# EAGLE design bt-ir-blaster (EAGLE 6.5.0)
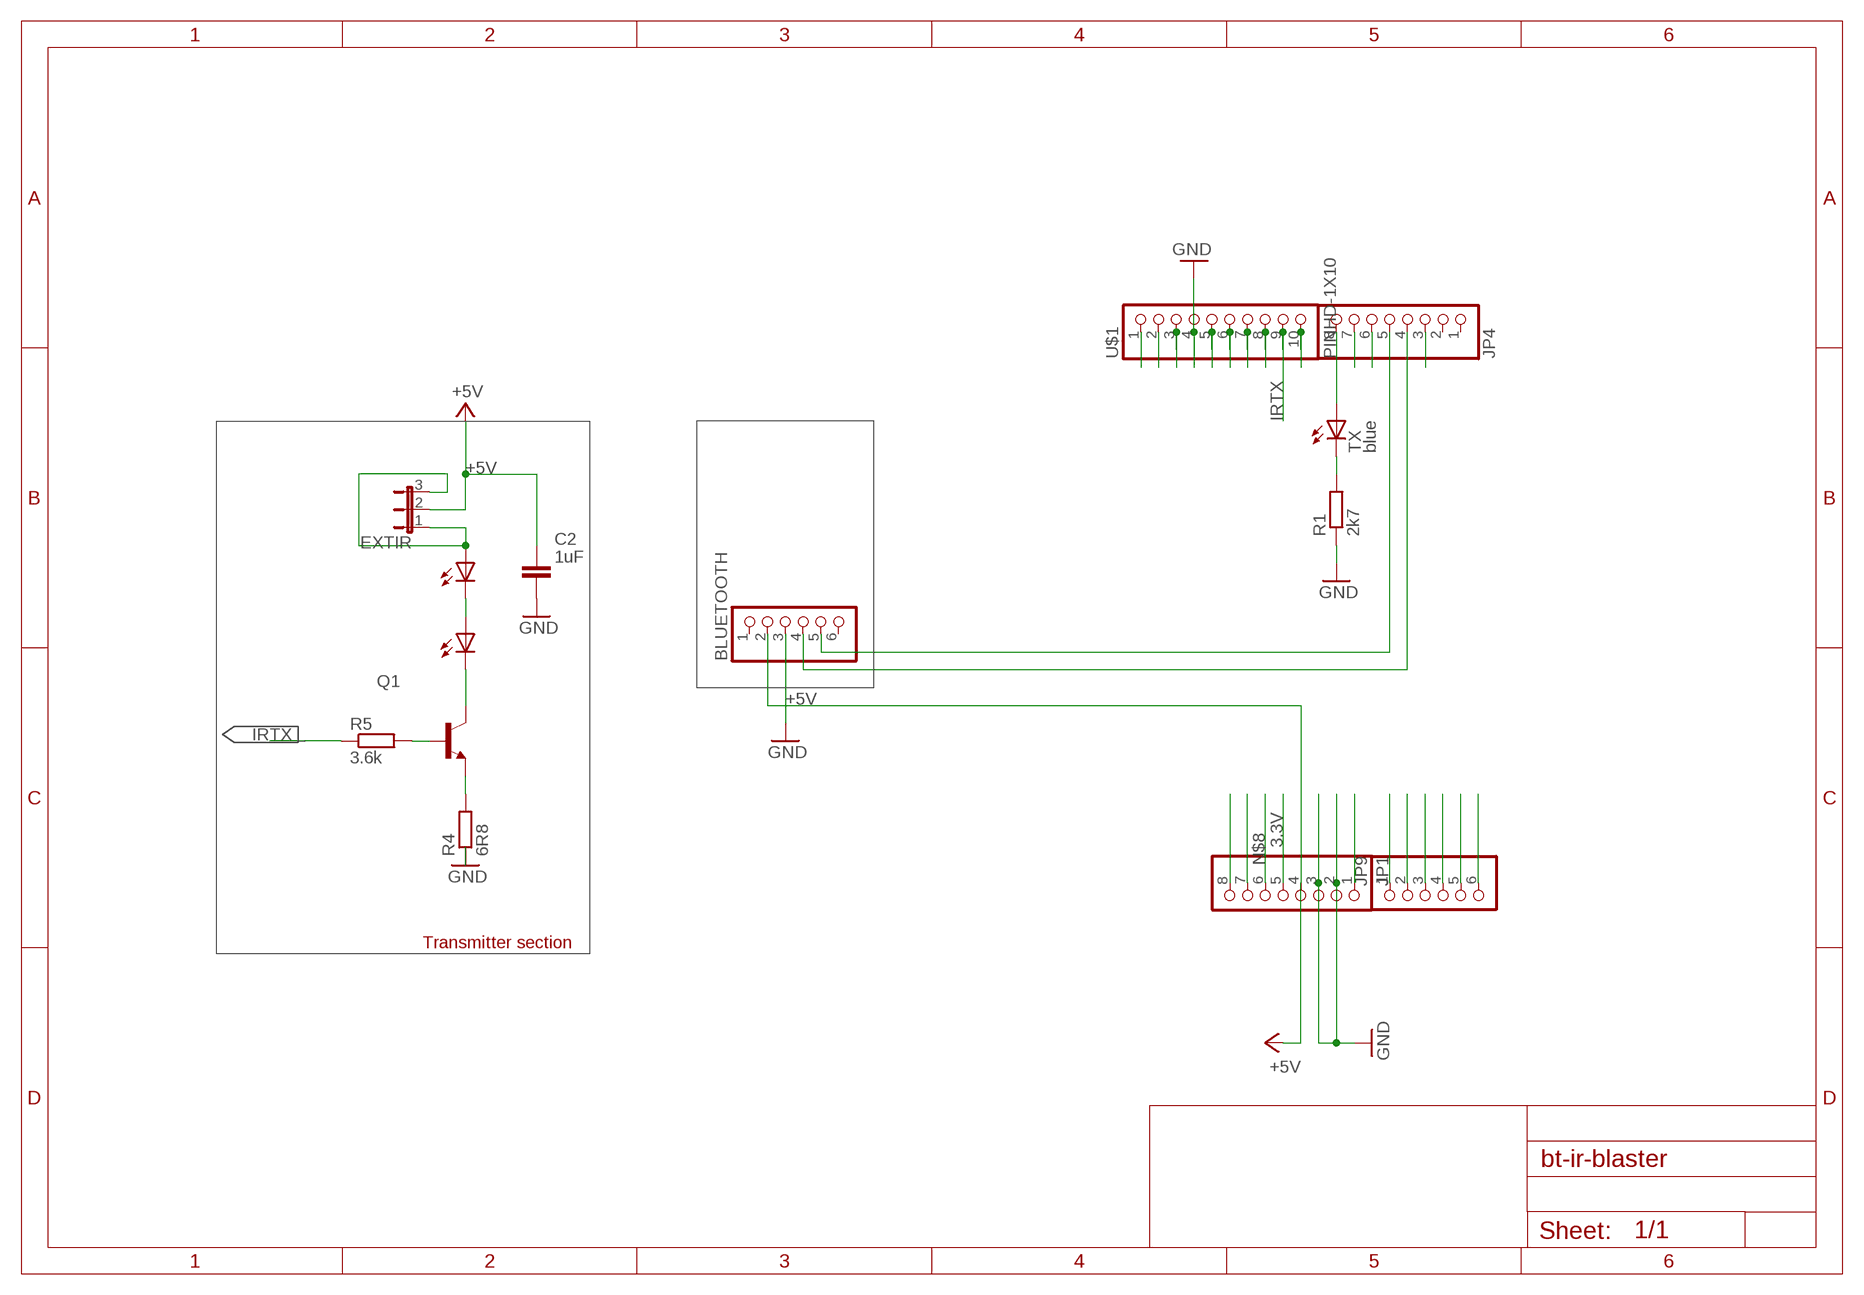
[diagram p0: schematic, sheet 1]

## Parts
BLUETOOTH  PINHD-1X6  [1X06]
C2  1uF  CAPACITOR_NPOL-0603  [C603@1]
EXTIR  JP2E  [JP2]
JP1  PINHD-1X8BIG  [1X08-BIG]
JP4  PINHD-1X8BIG  [1X08-BIG]
JP9  PINHD-1X6B  [1X06-BIG]
Q1  TRANSISTOR_BJT_NPN-SOT-23-BCE  [SOT-23]
R1  2k7  R-EU_R0805  [R0805]
R4  6R8  R-EU_R1206  [R1206]
R5  3.6k  R-EU_R0603  [R0603]
TX  blue  LED3MM  [LED3MM]
U$1  PINHD-1X10  [1X10-BIG]
U$5  IRLED5MM  [IRLED_HOLDER]
U$7  IRLED5MM  [IRLED_HOLDER]

## Nets
3.3V: JP1.5
+5V: BLUETOOTH.2 C2.1 EXTIR.2 JP1.4
A: Q1.2(C) U$5.K(C)
GND: BLUETOOTH.3 C2.2 JP1.2 JP1.3 R1.1 R4.1 U$1.4
IRTX: R5.1 U$1.9
K: Q1.3(E) R4.2
N$2: U$1.3
N$3: Q1.1(B) R5.2
N$4: JP1.8
N$5: U$1.5
N$6: U$5.A U$7.K(C)
N$7: R1.2 TX.K(C)
N$8: JP1.6
N$9: EXTIR.1 EXTIR.3 U$7.A
N$15: JP1.7
N$45: U$1.6
N$54: U$1.7
N$55: U$1.8
N$57: U$1.10
N$58: JP9.1
N$59: JP9.2
N$70: JP9.3
N$88: JP9.4
N$89: JP9.5
N$92: JP9.6
N$93: BLUETOOTH.4 JP4.4
N$94: BLUETOOTH.5 JP4.5
N$115: JP4.3
N$135: JP4.6
N$145: JP4.7
N$152: JP4.8 TX.A
N$153: JP1.1
N$154: U$1.1
N$164: U$1.2
Unconnected: BLUETOOTH.1 BLUETOOTH.6 JP4.1 JP4.2

## Notes on the sheet
- Transmitter section

## Library data of the parts
BLUETOOTH = pinhead:PINHD-1X6: PIN HEADER
C2 = dp_devices:CAPACITOR_NPOL: Non-Polarized capacitor in various packages
EXTIR = jumper:JP2E: JUMPER
JP1 JP4 = carduino:PINHD-1X8: PIN HEADER
JP9 = carduino:PINHD-1X6: PIN HEADER
Q1 = dp_devices:TRANSISTOR_BJT_NPN: Most commonly used is SOT23-BEC
R1 R4 R5 = resistor:R-EU_: RESISTOR, European symbol
TX = led:LED: LED OSRAM: - CHIPLED LG R971, LG N971, LY N971, LG Q971, LY Q971, LO R971, LY R971 LH N974, LH R974 LS Q976, LO Q976, LY Q976 LO Q996 - Hyper CHIPLED LW Q18S LB Q993, LB Q99A, LB R99A - SideLED LS A670, LO A670, LY A670, LG A670, LP A670 LB A673, LV A673, LT A673, LW A673 LH A674 LY A675 LS A676, LA A676, LO A676, LY A676, LW A676 LS A679, LY A679, LG A679 - Hyper Micro SIDELED® LS Y876, LA Y876, LO Y876, LY Y876 LT Y87S - SmartLED LW L88C, LW L88S LB L89C, LB L89S, LG L890 LS L89K, LO L89K, LY L89K LS L896, LA L896, LO L896, LY L896 - TOPLED LS T670, LO T670, LY T670, LG T670, LP T670 LSG T670, LSP T670, LSY T670, LOP T670, LYG T670 LG T671, LOG T671, LSG T671 LB T673, LV T673, LT T673, LW T673 LH T674 LS T676, LA T676, LO T676, LY T676, LB T676, LH T676, LSB T676, LW T676 LB T67C, LV T67C, LT T67C, LS T67K, LO T67K, LY T67K, LW E67C LS E67B, LA E67B, LO E67B, LY E67B, LB E67C, LV E67C, LT E67C LW T67C LS T679, LY T679, LG T679 LS T770, LO T770, LY T770, LG T770, LP T770 LB T773, LV T773, LT T773, LW T773 LH T774 LS E675, LA E675, LY E675, LS T675 LS T776, LA T776, LO T776, LY T776, LB T776 LHGB T686 LT T68C, LB T68C - Hyper Mini TOPLED® LB M676 - Mini TOPLED Santana® LG M470 LS M47K, LO M47K, LY M47K Source: http://www.osram.convergy.de LUXEON: - LUMILED® LXK2-PW12-R00, LXK2-PW12-S00, LXK2-PW14-U00, LXK2-PW14-V00 LXK2-PM12-R00, LXK2-PM12-S00, LXK2-PM14-U00 LXK2-PE12-Q00, LXK2-PE12-R00, LXK2-PE12-S00, LXK2-PE14-T00, LXK2-PE14-U00 LXK2-PB12-K00, LXK2-PB12-L00, LXK2-PB12-M00, LXK2-PB14-N00, LXK2-PB14-P00, LXK2-PB14-Q00 LXK2-PR12-L00, LXK2-PR12-M00, LXK2-PR14-Q00, LXK2-PR14-R00 LXK2-PD12-Q00, LXK2-PD12-R00, LXK2-PD12-S00 LXK2-PH12-R00, LXK2-PH12-S00 LXK2-PL12-P00, LXK2-PL12-Q00, LXK2-PL12-R00 Source: www.luxeon.com KINGBRIGHT: KA-3528ASYC Source: www.kingbright.com
U$1 = adafruit:PINHD-1X10: Pin header 1x10 0.1" spacing With round pins
U$5 U$7 = IRLED_holder:IRLED5MM

## Net classes
2 gnd: width 0.305 mm, drill 0.559 mm, clearance 0.254 mm
3 usbvcc: width 0.305 mm, drill 0.61 mm, clearance 0.254 mm

## Board
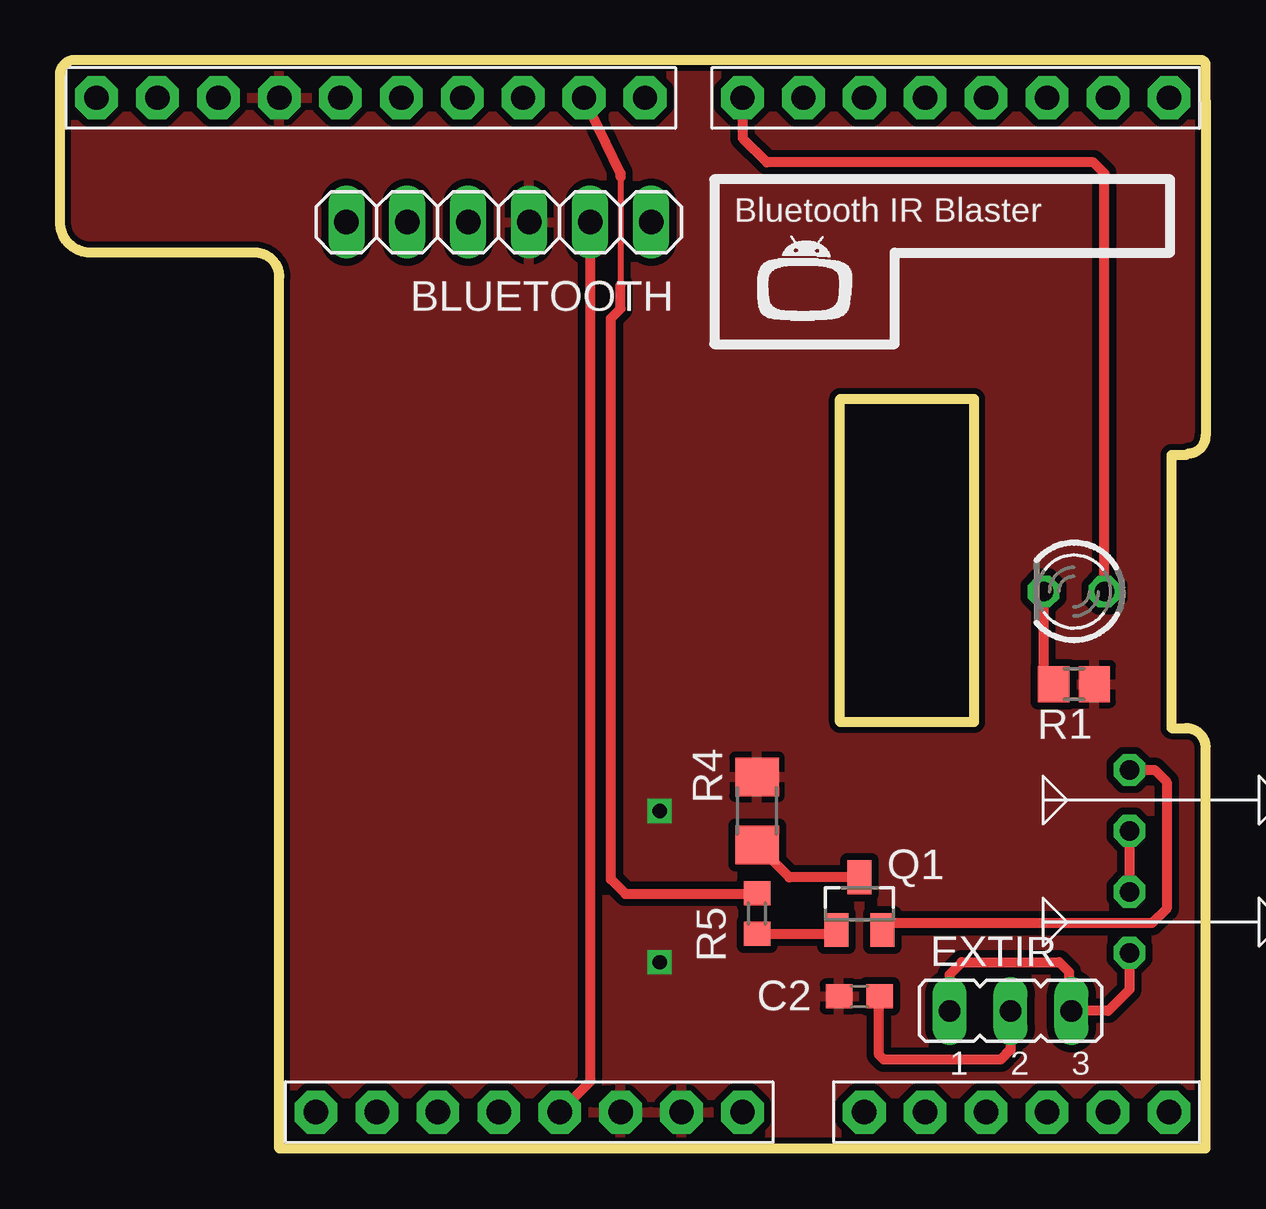
[diagram p1: board, top side]
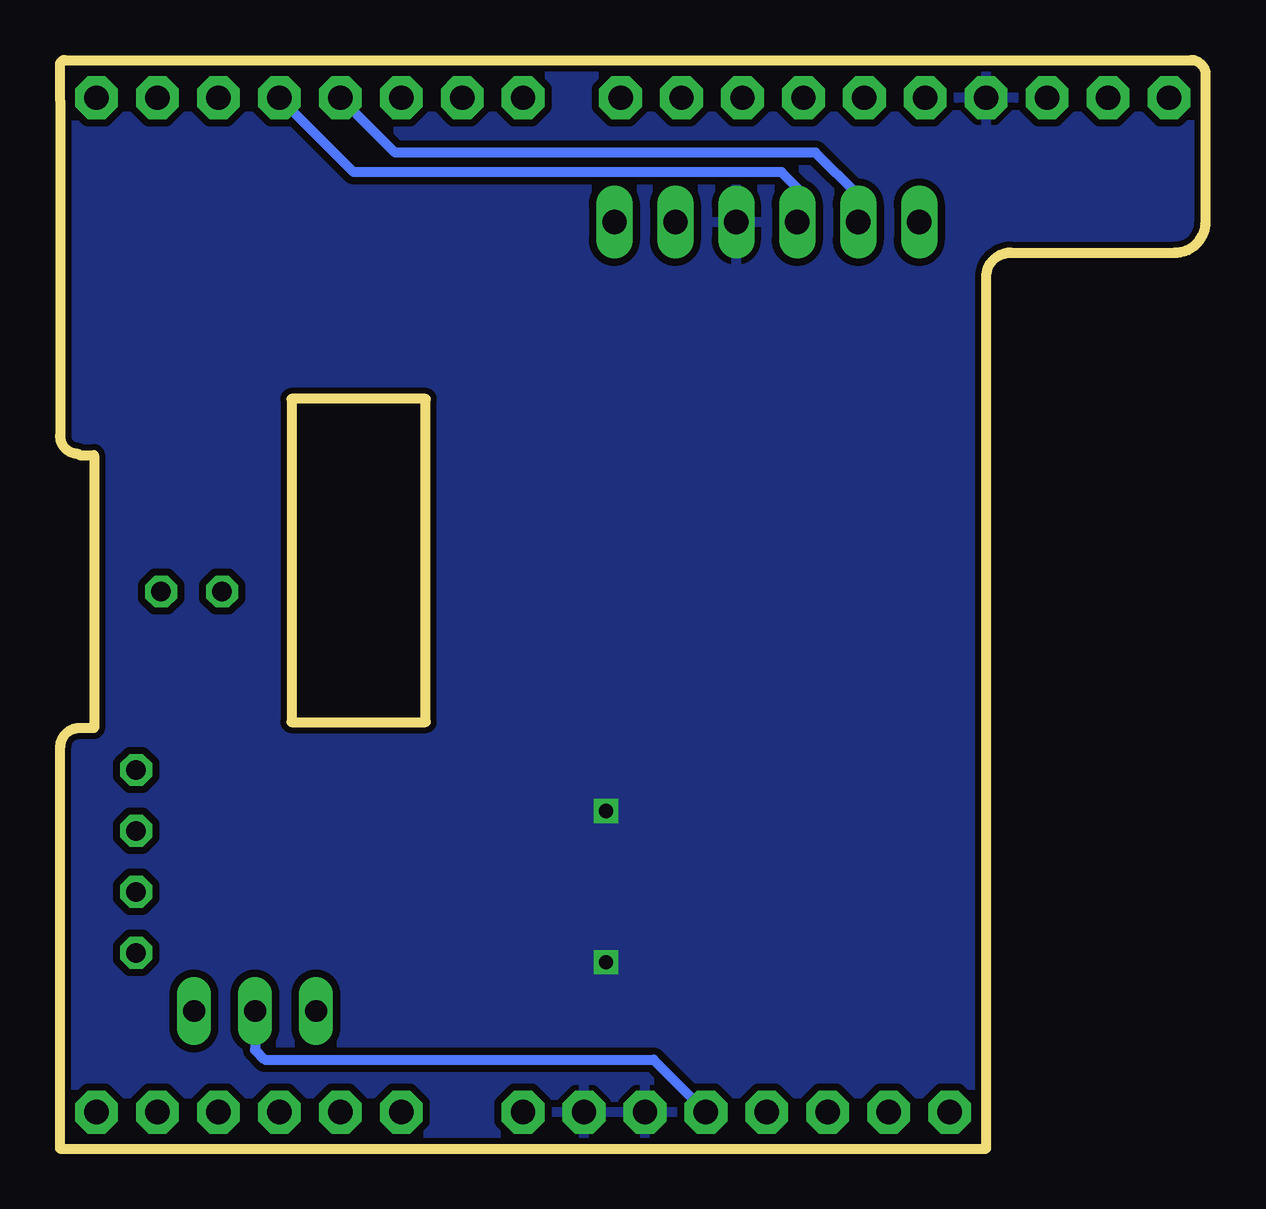
[diagram p2: board, bottom side, seen from below]

Size 47.75 x 45.36 mm. Coordinates in mm from the lower left corner, seen from the top.
Outline: 47.75,0 9.14,0 9.14,36.32 arc90 8.13,37.34 1.27,37.34 arc-90 0,38.61 0,44.76 arc-90 0.61,45.36 47.55,45.36 arc-90 47.75,45.16 47.75,43.74
Outline: 47.75,43.69 47.75,29.72 arc-90 46.99,28.96
Outline: 47.75,0.05 47.75,16.71 arc90 46.94,17.53 46.33,17.53 46.33,28.91 46.94,28.91
Outline: 32.51,31.24 38.1,31.24 38.1,17.78 32.51,17.78 32.51,31.24
Copper layers (1*16): Top 0.035mm / dielectric 1.5mm / Bottom 0.035mm
Design rules "adafruit *": minimum track width 8mil, minimum drill 15.5mil, track to track 12mil, track to pad 12mil, pad to pad 12mil, via to via 10mil, smd to smd 8mil, copper to edge 10mil, drill to drill 10mil, minimum pad ring 10mil, minimum via ring 8mil, stop-mask expansion 0mil, vias tented up to drill 30mil, thermal gap 10mil

### Footprints (pad centres in the part's own frame; a part is rotated, then mirrored left to right if it is on the bottom)
1X06 = drill 1.016 long: 1 -6.35,0; 2 -3.81,0; 3 -1.27,0; 4 1.27,0; 5 3.81,0; 6 6.35,0
C603@1 = smd 1.1 x 1: 1 -0.85,0; 2 0.85,0
JP2 = drill 0.914 long: 1 -2.54,0; 2 0,0; 3 2.54,0
1X08-BIG = drill 1.016 pad 1.778 octagon: 1 -8.89,0; 2 -6.35,0; 3 -3.81,0; 4 -1.27,0; 5 1.27,0; 6 3.81,0; 7 6.35,0; 8 8.89,0
1X06-BIG = drill 1.016 pad 1.778 octagon: 1 -6.35,0; 2 -3.81,0; 3 -1.27,0; 4 1.27,0; 5 3.81,0; 6 6.35,0
SOT-23 = smd 1 x 1.4: 1 -0.95,-1.1; 2 0.95,-1.1; 3 0,1.1
R0805 = smd 1.3 x 1.5: 1 -0.85,0; 2 0.85,0
R1206 = smd 1.6 x 1.803: 1 -1.422,0; 2 1.422,0
R0603 = smd 1 x 1.1: 1 -0.85,0; 2 0.85,0
LED3MM = drill 0.813 octagon: A -1.27,0; K 1.27,0
1X10-BIG = drill 1.016 pad 1.778 octagon: 1 -11.43,0; 2 -8.89,0; 3 -6.35,0; 4 -3.81,0; 5 -1.27,0; 6 1.27,0; 7 3.81,0; 8 6.35,0; 9 8.89,0; 10 11.43,0
IRLED_HOLDER = drill 0.813 octagon: A 5.41,4.28; K 5.41,1.74

### Placement (x,y rotation side)
BLUETOOTH  18.29,38.61 180 top
C2  33.32,6.35 180 top
EXTIR  39.62,5.74 0 top
JP1  19.56,1.52 180 top
JP4  37.34,43.79 180 top
JP9  39.88,1.52 0 top
Q1  33.32,10.21 0 top
R1  42.27,19.35 180 top
R4  29.06,14.07 270 top
R5  29.06,9.8 270 top
TX  42.27,23.22 180 top
U$1  12.95,43.79 0 top
U$5  49.99,17.53 180 top
U$7  49.99,12.45 180 top
U$44  [IRDROIDLOGO]  28.75,34.24 0 top

### Tracks (layer width: path | path; a pad name or v marks a point on that pad's centre or on a via)
+5V
  Top 0.406: EXTIR.2 39.62,4.12 39.22,3.71 34.34,3.71 34.14,3.91 34.14,6.31 C2.1 | BLUETOOTH.2 22.1,2.79 JP1.4
  Bottom 0.406: EXTIR.2 39.62,4.12 39.22,3.71 23.01,3.71 JP1.4
A
  Top 0.406: U$5.K 45.63,15.79 46.13,15.29 46.13,10.01 45.52,9.4 34.56,9.4 Q1.2
GND  (via drill 0.6)
  other vias: 24.99,14.07 24.99,7.77
  pour Bottom: 47.75,45.36 0.41,45.36 arc90 0,44.96 0,38.86 arc90 1.42,37.44 7.92,37.44 arc-90 9.14,36.22 9.14,0.05 arc90 9.35,-0.15 47.55,-0.15 arc90 47.75,0.05 47.75,16.71 arc90 46.94,17.53 46.33,17.53 46.33,28.91 46.94,28.91 arc90 47.75,29.72
  pour Top: 47.75,45.36 0.61,45.36 arc90 0,44.75 0,38.66 arc90 1.22,37.44 7.92,37.44 arc-90 9.14,36.22 9.14,0.25 arc90 9.35,0.05 47.55,0.05 arc90 47.75,0.25 47.75,16.71 arc90 46.94,17.53 46.53,17.53 arc-90 46.33,17.73 46.33,28.7 arc-90 46.53,28.91 46.94,28.91 arc90 47.75,29.72
IRTX
  Top 0.254: 23.37,40.49 23.37,36.02
  Top 0.406: 23.37,36.02 23.37,35 22.96,34.59 22.96,11.23 23.57,10.62 29.02,10.62 R5.1 | 23.37,40.49 23.37,40.64 U$1.9
K
  Top 0.406: Q1.3 30.4,11.31 R4.2
N$3
  Top 0.406: R5.2 32.22,8.95 Q1.1
N$6
  Top 0.406: U$5.A U$7.K
N$7
  Top 0.406: TX.K 41,19.77 R1.2
N$9
  Top 0.406: EXTIR.1 37.08,7.26 37.59,7.77 41.66,7.77 42.06,7.37 42.06,5.84 EXTIR.3 43.69,5.74 44.58,6.63 U$7.A
N$93
  Bottom 0.406: BLUETOOTH.4 17.02,40.03 17.68,40.69 35.51,40.69 JP4.4
N$94
  Bottom 0.406: BLUETOOTH.5 14.48,39.73 16.26,41.5 33.78,41.5 JP4.5
N$152
  Top 0.406: JP4.8 28.45,42.11 29.46,41.1 43.08,41.1 43.54,40.64 TX.A

### Text on the board
tNames: Bluetooth IR Blaster